# EAGLE design Markise-Relais (EAGLE 7.4.0)
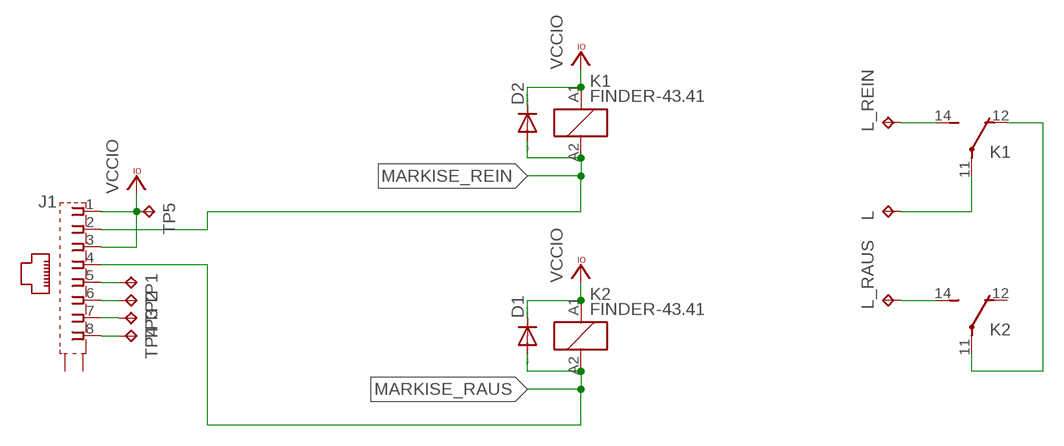
[diagram p0: schematic, sheet 1]

## Parts
D1  DIODE-D-7.5  [D-7.5]
D2  DIODE-D-7.5  [D-7.5]
J1  555141-1  [555153-1]
K1  FINDER-43.41  [FINDER-43.41]
K2  FINDER-43.41  [FINDER-43.41]
L  TPPAD1-20Y  [P1-20Y]
L_RAUS  TPPAD1-20Y  [P1-20Y]
L_REIN  TPPAD1-20Y  [P1-20Y]
TP1  TPPAD1-13  [P1-13]
TP2  TPPAD1-13  [P1-13]
TP3  TPPAD1-13  [P1-13]
TP4  TPPAD1-13  [P1-13]
TP5  TPPAD1-13  [P1-13]

## Nets
MARKISE_RAUS: D1.A J1.4 K2.A2
MARKISE_REIN: D2.A J1.2 K1.A2
N$1: K1.11(-2:P) L.TP
N$2: K1.14(-2:S) L_REIN.TP
N$3: K1.12(-2:O) K2.11(-2:P)
N$4: K2.14(-2:S) L_RAUS.TP
N$5: J1.5 TP1.TP
N$6: J1.6 TP2.TP
N$7: J1.7 TP3.TP
N$8: J1.8 TP4.TP
VCCIO: D1.C D2.C J1.1 J1.3 K1.A1 K2.A1 TP5.TP
Unconnected: J1.G1(S1) J1.G2(S2) K2.12(-2:O)

## Library data of the parts
D1 D2 = diode:DIODE-: DIODE
J1 = con-amp:555141-1: AMP connector
K1 K2 = relay_fin4341:FINDER-43.41: SUBMINIATURE DIL-RELAIS FINDER 43.41.7.005.0000 Kontakt max. AC - 250V 10A
L L_RAUS L_REIN TP1-TP5 = testpad:TP: Test pad

## Board
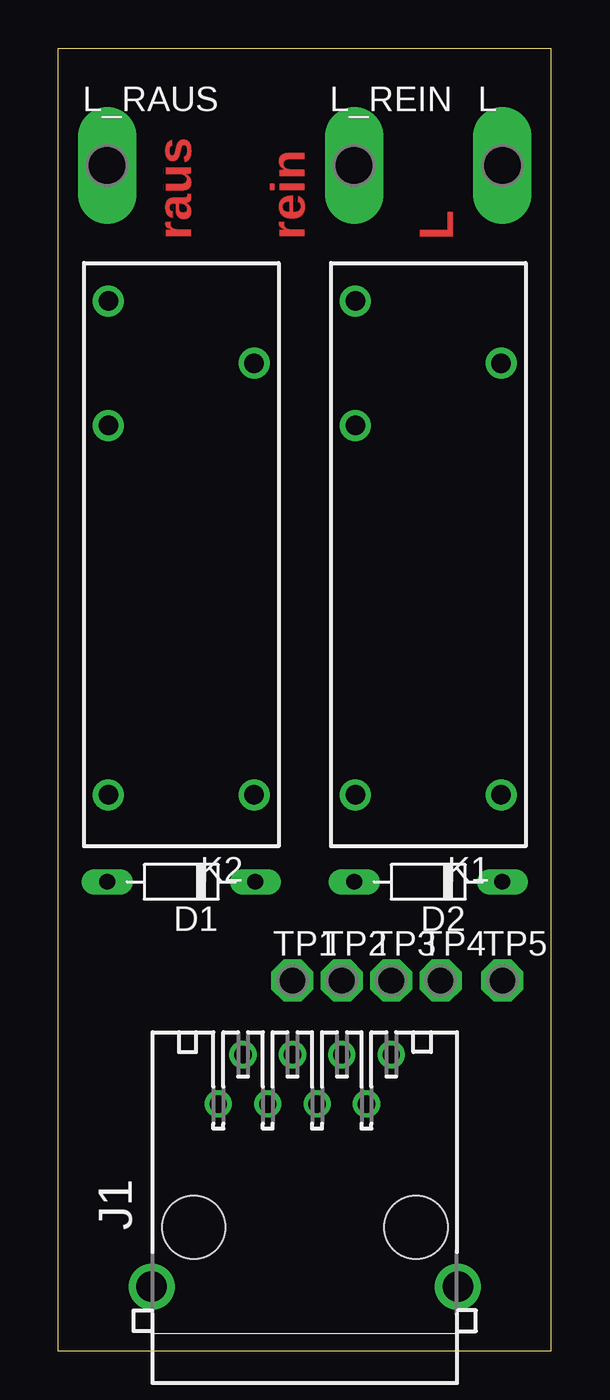
[diagram p1: board, top side]
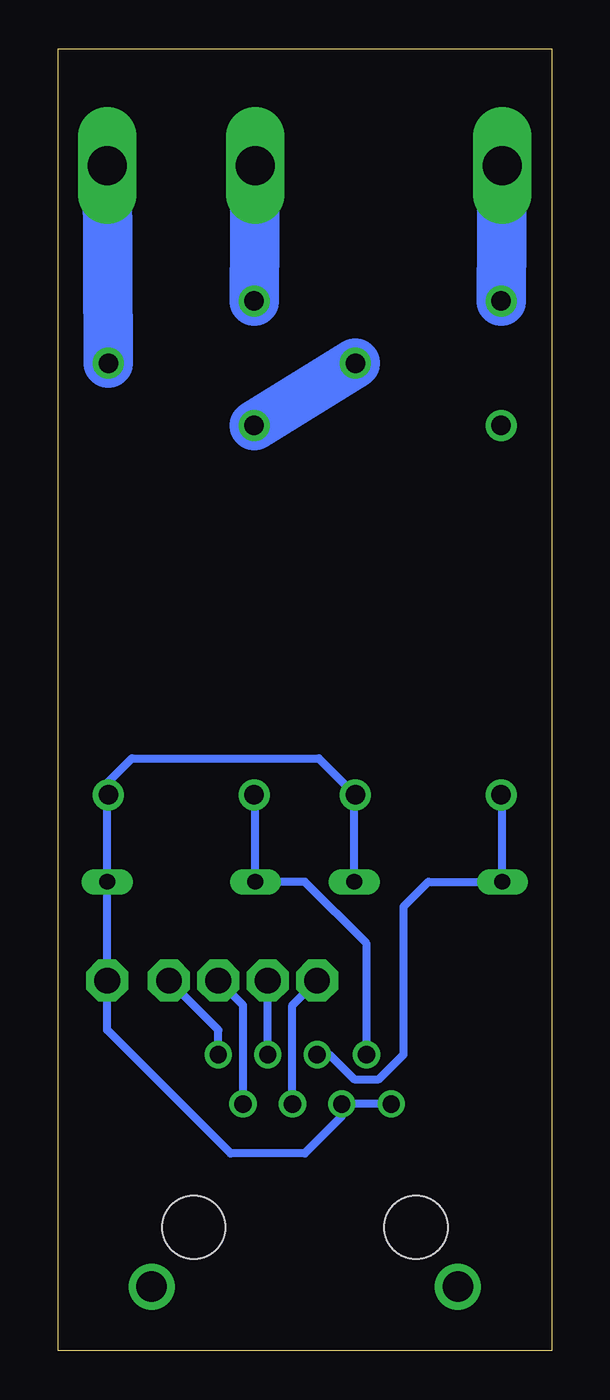
[diagram p2: board, bottom side, seen from below]

Size 25.38 x 66.98 mm. Coordinates in mm from the lower left corner, seen from the top.
Outline: 0,0 25.38,0 25.38,66.98 0,66.98 0,0
Copper layers (1*16): Top 0.035mm / dielectric 1.5mm / Bottom 0.035mm
Design rules "default": minimum track width 10mil, minimum drill 24mil, track to track 8mil, track to pad 8mil, pad to pad 8mil, via to via 8mil, smd to smd 8mil, copper to edge 40mil, drill to drill 8mil, minimum pad ring 10mil, minimum via ring 8mil, stop-mask expansion 4mil, vias tented up to drill 0mil, thermal gap 10mil

### Footprints (pad centres in the part's own frame; a part is rotated, then mirrored left to right if it is on the bottom)
D-7.5 = drill 0.813 long: A 3.81,0; C -3.81,0
555153-1 = drill 0.889: 1 -4.445,6.35; 2 -3.175,8.89; 3 -1.905,6.35; 4 -0.635,8.89; 5 0.635,6.35; 6 1.905,8.89; 7 3.175,6.35; 8 4.445,8.89 | drill 1.575 pad 2.184: G1 -7.874,-3.048; G2 7.874,-3.048 | hole 3.251: -5.715,0; 5.715,0
FINDER-43.41 = drill 1 pad 1.6: 11 0,-3.75; 12 -3.2,3.75; 14 3.2,3.75; A1 -22.2,-3.75; A2 -22.2,3.75
P1-20Y = drill 2.007 pad 2.54 long: TP 0,0
P1-13 = drill 1.321 pad 2.159 octagon: TP 0,0

### Placement (x,y rotation side)
D1  6.35,24.13 180 top
D2  19.05,24.13 180 top
J1  12.7,6.35 0 top
K1  19.05,50.8 90 top
K2  6.35,50.8 90 top
L  22.86,60.96 0 top
L_RAUS  2.54,60.96 0 top
L_REIN  15.24,60.96 0 top
TP1  12.06,19.05 0 top
TP2  14.61,19.05 0 top
TP3  17.14,19.05 0 top
TP4  19.68,19.05 0 top
TP5  22.86,19.05 0 top

### Tracks (layer width: path | path; a pad name or v marks a point on that pad's centre or on a via)
MARKISE_RAUS
  Bottom 0.406: K2.A2 2.54,28.54 D1.A 6.35,24.13 7.62,22.86 7.62,15.24 8.89,13.97 10.16,13.97 11.43,15.24 J1.4
MARKISE_REIN
  Bottom 0.406: K1.A2 15.24,28.54 D2.A 12.7,24.13 9.53,20.95 J1.2
N$1
  Bottom 2.54: K1.11 L.TP
N$2
  Bottom 2.54: K1.14 L_REIN.TP
N$3
  Bottom 2.54: K1.12 K2.11
N$4
  Bottom 2.54: K2.14 L_RAUS.TP
N$5
  Bottom 0.406: J1.5 13.34,17.78 TP1.TP
N$6
  Bottom 0.406: J1.6 TP2.TP
N$7
  Bottom 0.406: J1.7 15.88,17.78 TP3.TP
N$8
  Bottom 0.406: J1.8 17.14,16.51 TP4.TP
VCCIO
  Bottom 0.406: D1.C 10.16,28.54 K2.A1 11.98,30.48 21.59,30.48 22.8,29.27 K1.A1 22.86,28.54 D2.C TP5.TP 22.86,16.51 16.51,10.16 12.7,10.16 10.79,12.06 J1.3 J1.1

### Text on the board
Top: raus | rein | L